# Altium schematic sheet TPS62291DRVT.SchDoc
size A
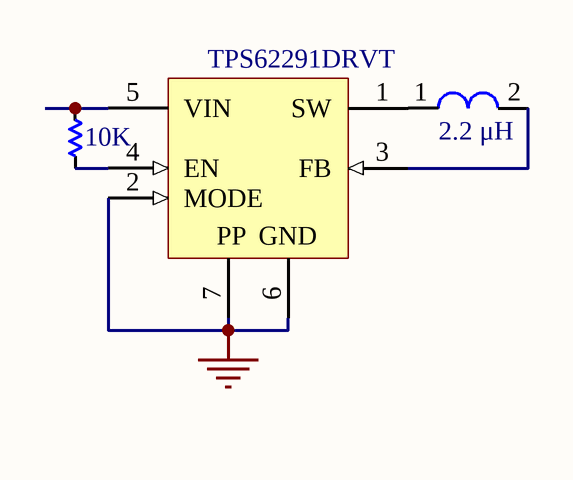
[diagram p0: TPS62291DRVT.SchDoc]

## Parts
L?  2.2 μH  [L-SMD-M-7.3x4.5]
R?  10K  [RES-SMD-0805]
U?  TPS62291DRVT  [DRV0006A_V]

## Nets
GND: U?.2(MODE) U?.6(GND) U?.7(EP)
NetL?_1: L?.1 U?.1(SW)
NetL?_2: L?.2 U?.3(FB)
NetR?_1: R?.1 U?.5(VIN)
NetR?_2: R?.2 U?.4(EN)

## Notes on the sheet
- (in symbol CMP-0323-00380-3) PP

## Library data of the parts
L? = L-SMD-1: partNo: 78477010; Manufacturer: Wurth Elektronik; Inductance: 2.2 μH; ComponentLink1Description: Manufacturer; ComponentLink1URL: http://www.we-online.de; Created by: Baojun Chen; Created Date: Nov.2015; ComponentLink2Description: Datasheet; ComponentLink2URL: http://katalog.we-online.de/pbs/datasheet/78477010.pdf
R? = Res-SMD: Resistor; Manufacturer: Generic Components; Class: Passive; Published: 08/06/2000; Publisher: Altium Hobart Technology Centre
U? = CMP-0323-00380-3: Buck Step Down Regulator with 2.3 to 6 V Input and 3.3 V Output, -40 to 85 degC, 6-Pin SON (DRV), Green (RoHS & no Sb/Br); Manufacturer: Texas Instruments; Preset Vout(V): 3.3; Switch Current Limit(Typ)(A): 1.4; Synchronous Rectification: TRUE; Duty Cycle(Max)(%): 100; Iout(Max)(A): 1; Vin(Max)(V): 6; Iq(Typ)(mA): 0.015; Rating: Catalog; SubFamily: Step-Down Regulator; Vin(Min)(V): 2.3; PartNumber: TPS62291DRVT; Mounting Technology: Surface Mount; ComponentLink2Description: Package Specification; Topology: Buck; ComponentLink1Description: Datasheet; Eco-Plan: Green (RoHS & no Sb/Br); Regulated Outputs(#): 1; ComponentLink1URL: http://www.ti.com/general/docs/lit/getliterature.tsp?genericPartNumber=TPS62291&fileType=pdf; DatasheetVersion: SLVS764C; ComponentLink3Description: URL Link1; Vout(Min)(V): 3.3; Vout(Max)(V): 3.3; PackageDescription: 6-Pin Plastic Small Outline No-Lead, 2 x 2 x 0.8 mm Body, 0.65 mm Pitch, Exposed Pad; ComponentLink2URL: http://www.ti.com/litv/pdf/mpds216d; PackageReference: DRV0006A; ComponentLink3URL: Samples URL:http://www.ti.com/product/tps62291#samples; PackageVersion: revE, Oct-2010